# EasyEDA Pro project ProPrj_EasyFOC_2026-04-13.epro, schematic main
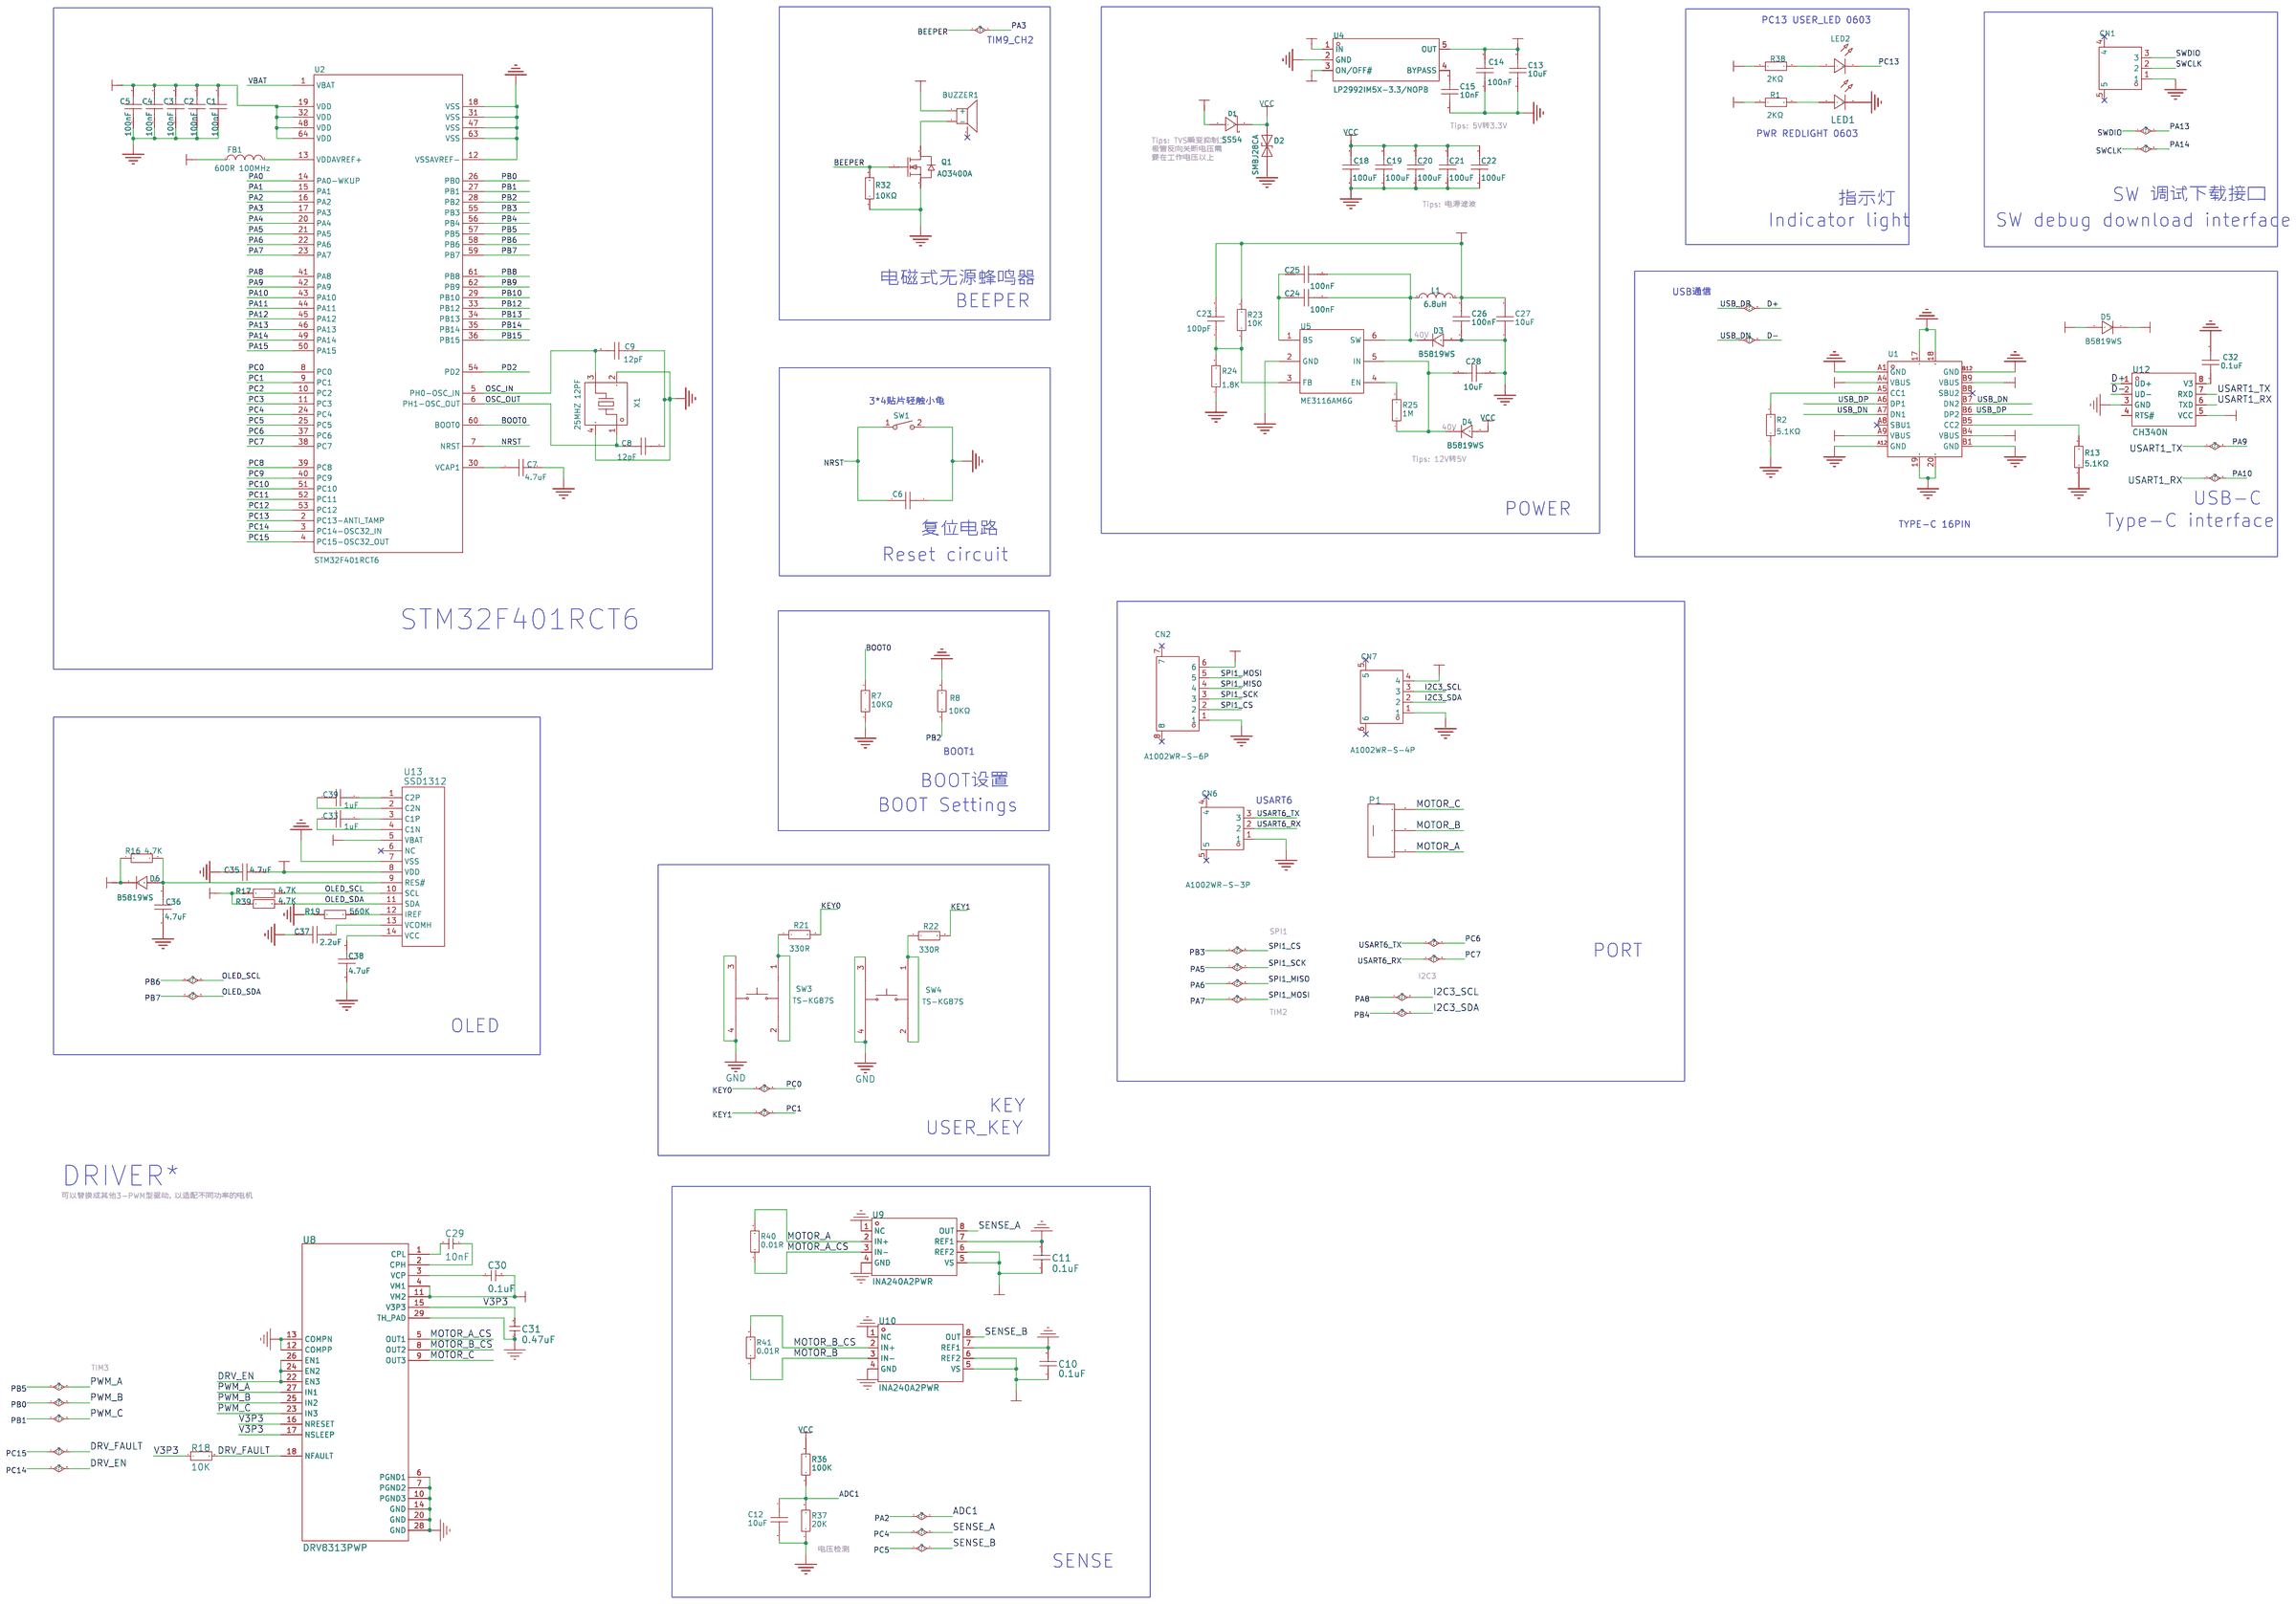
[diagram p1: schematic sheet]

## Parts
BUZZER1  4000Hz  [BUZ-SMD_L5.0-W5.5-P4.60]
C1  100nF  [C0402]
C2  100nF  [C0402]
C3  100nF  [C0402]
C4  100nF  [C0402]
C5  100nF  [C0402]
C6  100nF  [c0402]
C7  4.7uF  [C0402]
C8  12pF  [C0402]
C9  12pF  [C0402]
C10  0.1uF  [C0402]
C11  0.1uF  [C0402]
C12  10uF  [C0402]
C13  10uF  [C0402]
C14  100nF  [C0402]
C15  10nF  [C0402]
C18  100uF  [C1206]
C19  100uF  [C1206]
C20  100uF  [C1206]
C21  100uF  [C1206]
C22  100uF  [C1206]
C23  100pF  [C0402]
C24  100nF  [C0402]
C25  100nF  [C0402]
C26  100nF  [C0402]
C27  10uF  [C0402]
C28  10uF  [C0402]
C29  10nF  [C0402]
C30  0.1u  [C0402]
C31  0.47uF  [C0402]
C32  0.1uF  [C0402]
C33  1uF  [C0402]
C35  4.7uF  [C0402]
C36  4.7uF  [C0402]
C37  2.2uF  [C0402]
C38  4.7uF  [C0402]
C39  1uF  [C0402]
CN1  A1002WR-S-3P  [CONN-SMD_A1002WR-S-3P]
CN2  A1002WR-S-6P  [CONN-SMD_A1002WR-S-6P]
CN6  A1002WR-S-3P  [CONN-SMD_A1002WR-S-3P]
CN7  A1002WR-S-4P  [CONN-SMD_A1002WR-S-4P]
D1  SS54  [SMA_L4.4-W2.8-LS5.4-R-RD]
D2  SMBJ28CA  [SMB_L4.6-W3.6-LS5.3-BI]
D3  B5819WS  [SOD-323_L1.8-W1.3-LS2.5-RD]
D4  B5819WS  [SOD-323_L1.8-W1.3-LS2.5-RD]
D5  B5819WS  [SOD-323_L1.8-W1.3-LS2.5-RD]
D6  B5819WS  [SOD-323_L1.8-W1.3-LS2.5-RD]
FB1  600R 100MHz  [L0603]
L1  6.8uH  [IND-SMD_L2.0-W1.6_MHCD201610]
LED1  -  [led_0603]
LED2  -  [led_0603]
P1  电机接插件-3P  [AMASS-MR30-M]
Q1  AO3400A  [SOT-23-3_L2.9-W1.6-P1.90-LS2.8-BR]
R1  2KΩ  [r0402]
R2  5.1KΩ  [r0402]
R7  10KΩ  [r0402]
R8  10KΩ  [r0402]
R13  5.1KΩ  [r0402]
R16  4.7K  [R0402]
R17  4.7K  [R0402]
R18  10K  [R0402]
R19  560K  [R0402]
R21  330R  [r0402]
R22  330R  [r0402]
R23  10K  [R0402]
R24  1.8K  [R0402]
R25  1M  [R0402]
R32  10KΩ  [r0402]
R36  100K  [R0402]
R37  20K  [R0402]
R38  2KΩ  [r0402]
R39  4.7K  [R0402]
R40  0.01R  [R1206]
R41  0.01R  [R1206]
SW1  TS-1185-B-A-B-A  [SW-SMD_L4.0-W3.0-LS5.0]
SW3  TS-KG87S  [SW-SMD_4P-L5.2-W5.2-P3.70-LS6.4]
SW4  TS-KG87S  [SW-SMD_4P-L5.2-W5.2-P3.70-LS6.4]
U1  TYPE-C16PIN母座 板上四脚三次molding  [USB-SMD_TYPE-C16PIN]
U2  STM32F401RCT6  [LQFP-64_L10.0-W10.0-P0.50-LS12.0-BL]
U4  LP2992IM5X-3.3/NOPB  [SOT-23-5_L2.9-W1.6-P0.95-LS2.8-BR]
U5  ME3116AM6G  [SOT-23-6_L2.9-W1.6-P0.95-LS2.8-BL]
U8  *  [HTSSOP-28]
U9  INA240A2PWR  [TSSOP-8_L4.4-W3.0-P0.65-LS6.4-BL]
U10  INA240A2PWR  [TSSOP-8_L4.4-W3.0-P0.65-LS6.4-BL]
U12  CH340N  [SOP-8_L4.9-W3.9-P1.27-LS6.0-BL]
U13  SSD1312  [SSD1312-0.96寸]
X1  25MHZ 12PF  [CRYSTAL-SMD_4P-L3.2-W2.5-BL]

## Library data of the parts
BUZZER1 = MLT-5020: 驱动方式:无源(外部驱动);构造类型:电磁式;频率:4000Hz;长度:5.2mm;宽度:5.2mm;高度:2.5mm;; Supplier Part: C94598; Manufacturer: 华能; Supplier Footprint: SMD,5x5mm; JLCPCB Part Class: 扩展库; Datasheet: https://atta.szlcsc.com/upload/public/pdf/source/20210811/111454390007D221D7259018FB170E62.pdf; Supplier: LCSC; Oscillator Circuit: 无源(外部驱动); Technology Type: 电磁式; Length: 5.2mm; Width: 5.2mm; Height: 2.5mm
C1-C4 C13-C15 = CAP_0402: Supplier Footprint: 0603
C5 C7 C12 C23-C28 C32 C33 C35-C39 = CAP_0402: Supplier Footprint: 0402
C6 C8 C9 = CAP_0402: Supplier Footprint: 0805
C10 C11 = CAP_0402: Capacitor; Published: 8-Jun-2000; LatestRevisionDate: 17-Jul-2002; LatestRevisionNote: Re-released for DXP Platform.; PackageReference: RAD-0.3; Publisher: Altium Limited; PackageDescription: Radial Cap, Thru-Hole; 2 Leads; 0.3 in Pin Spacing; Design Item ID: Cap; Library Name: simple_foc
C18-C22 = CAP_1206: Supplier Footprint: 1206
C29-C31 = CAP_0402: Capacitor; Design Item ID: 电容-0402; Library Name: MyPcbLib
CN1 CN6 = A1002WR-S-3P: 系列:SH;连接器类型:接头;触头类型:公形引脚;间距:0.039"(1.00mm);针脚数:3;; LCSC Part Name: 3P,脚距1mm; Supplier Part: C239521; Manufacturer: CJT(长江连接器); Supplier Footprint: SMD,P=1mm; JLCPCB Part Class: 扩展库; Datasheet: https://atta.szlcsc.com/upload/public/pdf/watermark/20190926/C239521_19DE1B428A7F1E3979375D9C369EC94B.pdf; Supplier: LCSC; Series: SH; Connector Type: 接头; Contact Type: 公形引脚; Pitch: 0.039"(1.00mm); Number of Positions: 3; Number of Rows: 1; Mounting Type: 表面贴装; Contact Material: 磷青铜
CN2 = A1002WR-S-6P: 参考系列:SH;间距:1mm;插针结构:1x6P;排数:1;每排PIN数:6;行距:-;安装方式:-;触头材质:磷青铜;; LCSC Part Name: SH 1mm 1x6P; Supplier Part: C239524; Manufacturer: CJT(长江连接器); Supplier Footprint: SMD,P=1mm; JLCPCB Part Class: 扩展库; Datasheet: https://atta.szlcsc.com/upload/public/pdf/source/20190523/C338919_26A19BC9BEDA3DBF5CB743676AAF20C3.pdf; Supplier: LCSC; Reference Series: SH; Pitch: 1mm; Pins Structure: 1x6P; Number of Rows: 1; Number of PINs Per Row: 6; Contact Material: 磷青铜
CN7 = A1002WR-S-4P: 参考系列:SH;间距:1mm;插针结构:1x4P;排数:1;每排PIN数:4;行距:-;安装方式:-;触头材质:磷青铜;; LCSC Part Name: SH 1mm 1x4P; Supplier Part: C239522; Manufacturer: CJT(长江连接器); Supplier Footprint: SMD,P=1mm; JLCPCB Part Class: 扩展库; Datasheet: https://atta.szlcsc.com/upload/public/pdf/source/20190523/C338919_26A19BC9BEDA3DBF5CB743676AAF20C3.pdf; Supplier: LCSC; Reference Series: SH; Pitch: 1mm; Pins Structure: 1x4P; Number of Rows: 1; Number of PINs Per Row: 4; Contact Material: 磷青铜
D1 = SS54_C22452: 直流反向耐压（Vr）:40V;平均整流电流（Io）:5A;正向压降（Vf）:550mV @ 5A;; Supplier Part: C22452; Manufacturer: MDD; Supplier Footprint: SMA(DO-214AC); JLCPCB Part Class: 基础库; Supplier: LCSC
D2 = SMBJ28CA: 极性:双向;反向截止电压(Vrwm):28V;击穿电压:31.1V;反向漏电流(Ir):1uA;峰值脉冲电流(Ipp)@10/1000μs:13.2A;最大钳位电压:45.4V;; LCSC Part Name: 双向 Vrwm:28V; Supplier Part: C356756; Manufacturer: JJW(捷捷微); Supplier Footprint: SMB(DO-214AA); JLCPCB Part Class: 扩展库; Datasheet: https://atta.szlcsc.com/upload/public/pdf/source/20181226/C356756_7BEF6E7911DEC48405D550EEB7FD974D.pdf; Supplier: LCSC; Polarity: 双向; Reverse Stand-Off Voltage (Vrwm): 28V; Breakdown Voltage: 31.1V; Reverse Leakage Current (Ir): 1uA; Peak Pulse Current (Ipp)@10/1000μs: 13.2A; Maximum Clamping Voltage: 45.4V
D3-D6 = B5819WS_C179554: Supplier Part: C179554; Supplier Footprint: SOD-323; JLCPCB Part Class: 扩展库; Datasheet: https://atta.szlcsc.com/upload/public/pdf/source/20180131/C179554_15173931515471329165.pdf; Supplier: LCSC
FB1 = L_0603
L1 = MPH201612S6R8MT: 电感值:6.8uH;精度:±20%;额定电流:180mA;饱和电流(Isat):180mA;; LCSC Part Name: 6.8uH ±20% 180mA 170mΩ; Supplier Part: C2757911; Manufacturer: Sunlord(顺络); Supplier Footprint: SMD; JLCPCB Part Class: 扩展库; Datasheet: https://atta.szlcsc.com/upload/public/pdf/source/20210916/549400FA3A1352EC168D9D4559373742.pdf; Supplier: LCSC; Tolerance: ±20%; Rated Current: 180mA; Saturation Current (Isat): 180mA; DC Resistance (DCR): 170mΩ
LED1 LED2 = LED_0603: Supplier Footprint: 0805
P1 = 电机接插件-3P: AMASS MR30; Origin Footprint 2: AMASS-MR30-F; Library Name: MyPcbLib
Q1 = AO3400A_C20917: 漏源电压（Vdss）:30V;连续漏极电流（Id）（25°C 时）:5.7A;栅源极阈值电压:1.5V @ 250uA;漏源导通电阻:26.5mΩ @ 5.7A,10V;最大功率耗散（Ta=25°C）:1.4W;类型:N沟道;; Supplier Part: C20917; Manufacturer: AOS; Supplier Footprint: SOT-23-3L; JLCPCB Part Class: 基础库; Datasheet: https://atta.szlcsc.com/upload/public/pdf/source/20140107/1457706668533.pdf; Supplier: LCSC; Drain to Source Voltage(Vdss): 30V; Continuous Drain Current (Id) @ 25°C: 5.7A; Vgs(th) (Max) @ Id: 1.5V @ 250uA; Rds On (Max) @ Id, Vgs: 26.5mΩ @ 5.7A,10V; Power Dissipation-Max (Ta=25°C): 1.4W; FET Type: N沟道
R1 R2 R7 R8 R13 R21 R22 R32 R38 = Res_0402: Supplier Footprint: 0805
R16 R17 R19 R23-R25 R36 R37 R39 = Res_0402: Supplier Footprint: 0402
R18 = Res_0402: Resistor; Design Item ID: 电阻-0402; Library Name: MyPcbLib
R40 R41 = Res_1206: Supplier Footprint: 1206
SW1 = TS-1185-B-A-B-A: 触点电流:50mA;额定电压(DC):12V;绝缘电阻:-;电路结构:单刀单掷;安装方式:立贴;带灯:无;作用力:160gf;机械寿命:10万次;带支架:否;; LCSC Part Name: 4*3*2mm 立贴 轻触开关; Supplier Part: C561517; Manufacturer: XKB Connectivity(中国星坤); Supplier Footprint: SMD; JLCPCB Part Class: 扩展库; Datasheet: https://atta.szlcsc.com/upload/public/pdf/source/20211011/C2F26DC0AE1820400F54DBF49644F5A1.pdf; Supplier: LCSC; Contact Current: 50mA; Voltage Rating (DC): 12V; Circuit: 单刀单掷; Mounting Style: 立贴; Actuator Style: 圆形按钮; Actuator/Cap Color: 黑色; With Lamp: 无; Operating Force: 160gf; Mechanical Life: 10万次; Operating Temperature: -30℃~+85℃; Switch Length: 4mm; Switch Width: 3mm; Switch Height: 2mm; Strike Gundam: 否
SW3 SW4 = TS-KG87S_C2842616: 触点电流:50mA;额定电压(DC):12V;绝缘电阻:100MΩ;电路结构:单刀单掷;安装方式:立贴;按钮形状:圆形按钮;机械寿命:100000;工作温度:-20℃~+80℃;引脚样式:鸥翼型;开关长度:5.2mm;开关宽度:5.2mm;带支架:否;; LCSC Part Name: 轻触开关4*4*1.5-5mm; Supplier Part: C2842616; Manufacturer: HANBO(汉博); Supplier Footprint: SMD; JLCPCB Part Class: Extended Part; Datasheet: https://atta.szlcsc.com/upload/public/pdf/source/20221110/9F12368ABAADA707FA651461D566C3CD.pdf; Supplier: LCSC; Contact Current: 50mA; Voltage Rating (DC): 12V; Insulation Resistance: 100MΩ; Circuit: 单刀单掷; Mounting Style: 立贴; Actuator Style: 圆形按钮; Mechanical Life: 100000; Operating Temperature: -20℃~+80℃; Pin Style: 鸥翼型; Switch Length: 5.2mm; Switch Width: 5.2mm; Strike Gundam: 否
U1 = TYPE-C16PIN母座 板上四脚三次molding: Supplier Part: C9900000202; Supplier Footprint: TYPE-C16PIN; JLCPCB Part Class: Extended Part; Datasheet: 2021-09-15/03900G/aaf837f0873f462e9eab7ac60a9bb940/aac77-74p5r.pdf; Supplier: LCSC
U2 = STM32F401RCT6: CPU内核:ARM Cortex-M4;CPU最大主频:84MHz;工作电压范围:1.7V~3.6V;内部振荡器:有;程序 FLASH容量:256K@x8bit;RAM总容量:64KB;EEPROM/数据 FLASH容量:-;GPIO端口数量:50;ADC(单元数/通道数/位数):1@x16ch/12bit;外设/功能/协议栈:欠压检测/复位；DMA；看门狗；POR；PWM;工作温度范围:-40℃~+85℃;; LCSC Part Name: ARM Cortex-M4 84MHz 闪存：256K@x8bit RAM：64KB; Supplier Part: C74524; Manufacturer: ST(意法半导体); Supplier Footprint: LQFP-64(10x10); JLCPCB Part Class: 扩展库; Datasheet: https://atta.szlcsc.com/upload/public/pdf/source/20170728/C74524_1501225886278849063.pdf; Supplier: LCSC; CPU Core: ARM Cortex-M4; Maximum Frequency: 84MHz; Supply Voltage Range: 1.7V~3.6V; Internal Oscillator: 有; Program FLASH Size: 256K@x8bit; RAM Size: 64KB; GPIO Ports Number: 50; ADC (Units/Channels/bits): 1@x16ch/12bit; Peripherals / Functions / Protocol Stacks: 欠压检测/复位；DMA；看门狗；POR；PWM; Operating Temperature Range: -40℃~+85℃
U4 = LP2992IM5X-3.3/NOPB: 微功耗 250mA 低噪声超低压降稳压器 5-SOT-23 -40 to 125; Supplier Part: C2877731; Manufacturer: TI(德州仪器); Supplier Footprint: SOT-23-5; JLCPCB Part Class: 扩展库; Datasheet: https://atta.szlcsc.com/upload/public/pdf/source/20230221/4F3FB37702A60F10FC19CD69011A6AB4.pdf; Supplier: LCSC
U5 = ME3116AM6G_C97643: 功能类型:降压型;同步整流:-;输出通道数:-;拓扑结构:-;输入电压:-;输出电流(最大值):-;开关频率:-;; LCSC Part Name: 降压型; Supplier Part: C97643; Manufacturer: MICRONE(南京微盟); Supplier Footprint: SOT-23-6; JLCPCB Part Class: 扩展库; Datasheet: https://atta.szlcsc.com/upload/public/pdf/source/20170322/1490151692992.pdf; Supplier: LCSC; Function: 降压型
U8 = DRV8313PWP: 65-V max, 3-A peak 3-phase motor driver 28-HTSSOP -40 to 125; Availability: Good; SnapEDA_Link: https://www.snapeda.com/parts/DRV8313PWP/Texas%20Instruments/view-part/287728/?ref=snap; Price: None; Purchase-URL: https://pricing.snapeda.com/search/part/DRV8313PWP/?ref=eda; MF: Texas Instruments; Library Name: MyPcbLib
U9 U10 = INA240A2PWR: Library Name: simple_foc
U12 = CH340N_C2977777: Library Name: simple_foc
U13 = SSD1312
X1 = CJ13-080001210B20: Supplier Part: C2875274; Manufacturer: CJ(江苏长电/长晶); Supplier Footprint: 3225; JLCPCB Part Class: 扩展库; Datasheet: https://atta.szlcsc.com/upload/public/pdf/source/20210824/6E1F59D92CEEC2B7E10E0FA064B9C05B.pdf; Supplier: LCSC

## Nets
3.3V: BUZZER1.1(+) C1.2 C2.2 C3.2 C4.2 C5.2 C10.1 C11.1 C13.2 C14.2 C35.2 D6.1 FB1.1 R1.1 R16.1 R17.1 R38.1 R39.1 U2.19(VDD) U2.32(VDD) U2.48(VDD) U2.64(VDD) U4.5(OUT) U9.5(VS) U9.6(REF2) U10.5(VS) U10.6(REF2) U13.5(VBAT) U13.8(VDD)
5V: C23.2 C26.2 C27.2 CN2.6 CN7.4 D5.1 L1.2 R23.2 U4.1(IN) U4.3(ON/OFF#) U12.5(VCC)
GND: C1.1 C2.1 C3.1 C4.1 C5.1 C6.2 C7.2 C8.1 C9.1 C10.2 C11.2 C12.2 C13.1 C14.1 C15.1 C18.1 C19.1 C20.1 C21.1 C22.1 C26.1 C27.1 C28.2 C31.1 C32.2 C35.1 C36.1 C37.1 C38.1 CN1.1 CN2.1 CN6.1 CN7.1 D2.1(K) D3.2 LED1.1(C) Q1.2(S) R2.1 R7.1 R8.2 R13.1 R19.1 R24.1 R32.1 R37.1 SW1.2 SW3.3 SW3.4 SW4.3 SW4.4 U1.17 U1.18 U1.19 U1.20 U1.A1(GND) U1.A12(GND) U1.B1(GND) U1.B12(GND) U2.12(VSSAVREF-) U2.18(VSS) U2.31(VSS) U2.47(VSS) U2.63(VSS) U4.2(GND) U5.2(GND) U8.6(PGND1) U8.7(PGND2) U8.10(PGND3) U8.12(COMPP) U8.13(COMPN) U8.14(GND) U8.20(GND) U8.28(GND) U8.29(TH_PAD) U9.1(NC) U9.4(GND) U9.7(REF1) U10.1(NC) U10.4(GND) U10.7(REF1) U12.3(GND) U13.7(VSS) X1.2(GND) X1.4(GND)
V3P3: C31.2 R18.1 U8.15(V3P3) U8.16(NRESET) U8.17(NSLEEP)
VBAT: U2.1(VBAT)
VBUS: D5.2 U1.A4(VBUS) U1.A9(VBUS) U1.B4(VBUS) U1.B9(VBUS)
VCC: C18.2 C19.2 C20.2 C21.2 C22.2 C30.2 D1.2(K) D2.2(A) D4.2 R36.2 U8.4(VM1) U8.11(VM2)
VCC_IN: D1.1(A)
ADC1: C12.1 R36.1 R37.2 U2.16(PA2)
BEEPER: Q1.1(G) R32.2 U2.17(PA3)
BOOT0: R7.2 U2.60(BOOT0)
D+: U1.A6(DP1) U1.B6(DP2) U12.1(UD+)
D-: U1.A7(DN1) U1.B7(DN2) U12.2(UD-)
DRV_EN: U2.3(PC14-OSC32_IN) U8.22(EN3) U8.24(EN2) U8.26(EN1)
DRV_FAULT: R18.2 U2.4(PC15-OSC32_OUT) U8.18(NFAULT)
I2C3_SCL: CN7.3 U2.41(PA8)
I2C3_SDA: CN7.2 U2.56(PB4)
KEY0: R21.2 U2.8(PC0)
KEY1: R22.2 U2.9(PC1)
MOTOR_A: P1.1 R40.2 U9.2(IN+)
MOTOR_A_CS: R40.1 U8.5(OUT1) U9.3(IN-)
MOTOR_B: P1.2 R41.1 U10.3(IN-)
MOTOR_B_CS: R41.2 U8.8(OUT2) U10.2(IN+)
MOTOR_C: P1.3 U8.9(OUT3)
NRST: C6.1 SW1.1 U2.7(NRST)
OLED_SCL: R17.2 U2.58(PB6) U13.10(SCL)
OLED_SDA: R39.2 U2.59(PB7) U13.11(SDA)
OSC_IN: C9.2 U2.5(PH0-OSC_IN) X1.3
OSC_OUT: C8.2 U2.6(PH1-OSC_OUT) X1.1
PA0: U2.14(PA0-WKUP)
PA1: U2.15(PA1)
PA4: U2.20(PA4)
PA5: CN2.3 U2.21(PA5)
PA6: CN2.4 U2.22(PA6)
PA7: CN2.5 U2.23(PA7)
PA9: U2.42(PA9) U12.7(RXD)
PA10: U2.43(PA10) U12.6(TXD)
PA11: U2.44(PA11)
PA12: U2.45(PA12)
PA13: CN1.3 U2.46(PA13)
PA14: CN1.2 U2.49(PA14)
PA15: U2.50(PA15)
PB0: U2.26(PB0) U8.25(IN2)
PB1: U2.27(PB1) U8.23(IN3)
PB2: R8.1 U2.28(PB2)
PB3: CN2.2 U2.55(PB3)
PB5: U2.57(PB5) U8.27(IN1)
PB8: U2.61(PB8)
PB9: U2.62(PB9)
PB10: U2.29(PB10)
PB12: U2.33(PB12)
PB13: U2.34(PB13)
PB14: U2.35(PB14)
PB15: U2.36(PB15)
PC2: U2.10(PC2)
PC3: U2.11(PC3)
PC4: U2.24(PC4) U9.8(OUT)
PC5: U2.25(PC5) U10.8(OUT)
PC6: CN6.3 U2.37(PC6)
PC7: CN6.2 U2.38(PC7)
PC8: U2.39(PC8)
PC9: U2.40(PC9)
PC10: U2.51(PC10)
PC11: U2.52(PC11)
PC12: U2.53(PC12)
PC13: LED2.1(C) U2.2(PC13-ANTI_TAMP)
PD2: U2.54(PD2)
$1N697: C7.1 U2.30(VCAP1)
$1N700: FB1.2 U2.13(VDDAVREF+)
$1N3019: LED1.2(A) R1.2
$1N3273: R21.1 SW3.1 SW3.2
$1N3301: R22.1 SW4.1 SW4.2
$1N3684: C15.2 U4.4(BYPASS)
$1N4533: C23.1 R23.1 R24.2 U5.3(FB)
$1N4677: C24.1 C25.1 U5.1(BS)
$1N5088: C24.2 C25.2 D3.1 L1.1 U5.6(SW)
$1N5153: R25.2 U5.4(EN)
$1N5247: C28.1 D4.1 R25.1 U5.5(IN)
$1N8073: C29.1 U8.1(CPL)
$1N8076: C29.2 U8.2(CPH)
$1N8080: C30.1 U8.3(VCP)
$1N8447: R2.2 U1.A5(CC1)
$1N8457: R13.2 U1.B5(CC2)
$1N8606: BUZZER1.2(-) Q1.3(D)
$1N12335: C32.1 U12.8(V3)
$1N14579: LED2.2(A) R38.2
$1N17688: C39.2 U13.1(C2P)
$1N17689: C39.1 U13.2(C2N)
$1N17690: C33.2 U13.3(C1P)
$1N17691: C33.1 U13.4(C1N)
$1N17703: R19.2 U13.12(IREF)
$1N17705: C37.2 U13.13(VCOMH)
$1N17707: C38.2 U13.14(VCC)
$1N17709: C36.2 D6.2 R16.2 U13.9(RES#)

Not connected (* = marked no-connect by the designer): BUZZER1 3(NC)*; CN1 4* 5*; CN2 7* 8*; CN6 4* 5*; CN7 5* 6*; U1 A8(SBU1)* B8(SBU2)*; U12 4(RTS#); U13 6(NC)*

## Notes on the sheet
- PC13 USER_LED 0603
- TIM9_CH2
- Tips: 5V转3.3V
- PWR REDLIGHT 0603
- Tips: TVS瞬变抑制二
  极管反向关断电压需
  要在工作电压以上
- Tips: 电源滤波
- 指示灯
- SW 调试下载接口
- Indicator light
- SW debug download interface
- 电磁式无源蜂鸣器
- USB通信
- BEEPER
- 40V
- 3*4贴片轻触小龟
- 40V
- Tips: 12V转5V
- USB-C
- POWER
- 复位电路
- TYPE-C 16PIN
- Type-C interface
- Reset circuit
- STM32F401RCT6
- BOOT1
- BOOT设置
- BOOT Settings
- USART6
- SPI1
- PORT
- I2C3
- TIM2
- OLED
- KEY
- USER_KEY
- DRIVER*
- 可以替换成其他3-PWM型驱动，以适配不同功率的电机
- TIM3
- 电压检测
- SENSE
